# Altium schematic sheet LEDProject.SchDoc
size A3
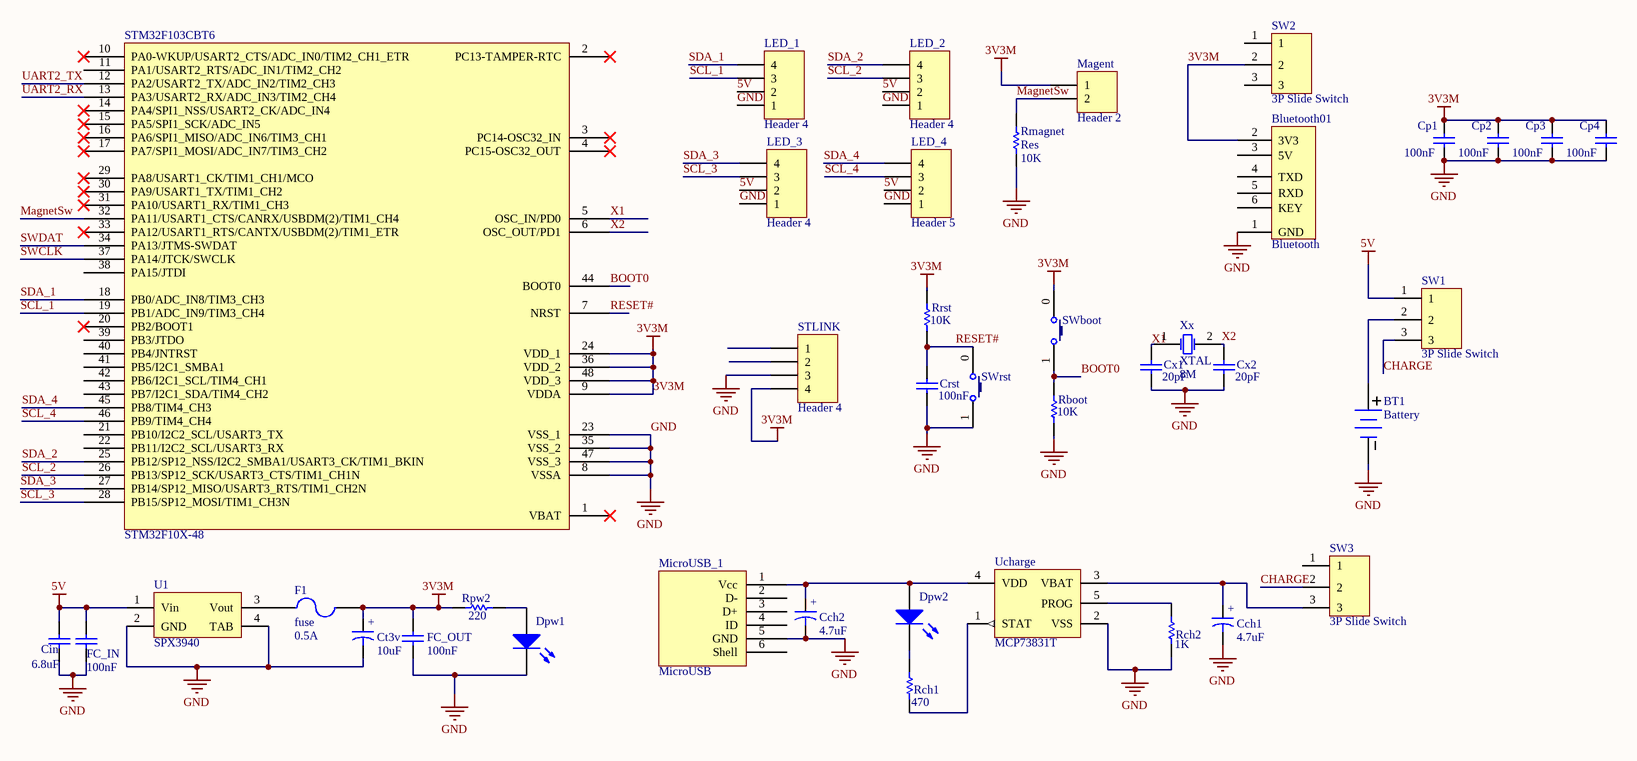
[diagram p0: LEDProject.SchDoc]

## Parts
Bluetooth01  Bluetooth  [Bluetooth Module]
BT1  Battery  [BAT-2]
Cch1  value 4.7uF  [Tantalum Cap Size A]  (hidden comment: CAP2)
Cch2  value 4.7uF  [Tantalum Cap Size A]  (hidden comment: CAP2)
Cin  value 6.8uF  [SMD-C-0805]  (hidden comment: CAP1)
Cp1  value 100nF  [SMD-C-0805]  (hidden comment: CAP1)
Cp2  value 100nF  [SMD-C-0805]  (hidden comment: CAP1)
Cp3  value 100nF  [SMD-C-0805]  (hidden comment: CAP1)
Cp4  value 100nF  [SMD-C-0805]  (hidden comment: CAP1)
Crst  value 100nF  [SMD-C-0805]  (hidden comment: CAP1)
Ct3v  value 10uF  [Tantalum Cap Size A]  (hidden comment: CAP2)
Cx1  value 20pF  [SMD-C-0805]  (hidden comment: CAP1)
Cx2  value 20pF  [SMD-C-0805]  (hidden comment: CAP1)
Dpw1  SMD LED  [SMT LED 0603]  (value not drawn)
Dpw2  SMD LED  [SMT LED 0603]  (value not drawn)
F1  fuse  value 0.5A  [FUSE_SMD]
FC_IN  value 100nF  [SMD-C-0805]  (hidden comment: CAP1)
FC_OUT  value 100nF  [SMD-C-0805]  (hidden comment: CAP1)
LED_1  Header 4  [HDR1X4]
LED_2  Header 4  [HDR1X4]
LED_3  Header 4  [HDR1X4]
LED_4  Header 5  [HDR1X4]
Magent  Header 2  [HDR1X2]
MicroUSB_1  MicroUSB  [MicroUSB]
Rboot  value 10K  [SMD-R-0603]  (hidden comment: Res)
Rch1  value 470  [SMD-R-0603]  (hidden comment: Res)
Rch2  value 1K  [SMD-R-0603]  (hidden comment: Res)
Rmagnet  Res  value 10K  [SMD-R-0603]
Rpw2  value 220  [SMD-R-0603]  (hidden comment: Res)
Rrst  value 10K  [SMD-R-0603]  (hidden comment: Res)
STLINK  Header 4  [HDR1X4]
STM32F103CBT6  STM32F10X-48  [LQFP48_N]
SW1  3P Slide Switch  [3P_Smooth_Switch_90]
SW2  3P Slide Switch  [3P_Smooth_Switch_90]
SW3  3P Slide Switch  [3P_Smooth_Switch_90]
SWboot  SWrst  [Button2_SMD]  (value not drawn)
SWrst  SWrst  [Button2_SMD]  (value not drawn)
U1  SPX3940  [SOT-223]
Ucharge  MCP73831T  [SOT23-5_N]
Xx  XTAL  value 8M  [CRYSTAL-2x6]

## Nets
3V3M: Bluetooth01.2(3V3) Cp1.2 Cp2.2 Cp3.2 Cp4.2 Ct3v.1 F1.2 FC_OUT.2 Magent.1 Rpw2.1 Rrst.2 STLINK.4 STM32F103CBT6.9(VDDA) STM32F103CBT6.24(VDD_1) STM32F103CBT6.36(VDD_2) STM32F103CBT6.48(VDD_3) SW2.2 SWboot.0
5V: Cin.2 FC_IN.2 LED_1.2 LED_2.2 LED_3.2 LED_4.2 SW1.1 U1.1(Vin)
GND: Bluetooth01.1(GND) BT1.2(-) Cch1.2 Cch2.2 Cin.1 Cp1.1 Cp2.1 Cp3.1 Cp4.1 Crst.2 Ct3v.2 Cx1.2 Cx2.2 Dpw1.2(K) FC_IN.1 FC_OUT.1 LED_1.1 LED_2.1 LED_3.1 LED_4.1 MicroUSB_1.5(GND) Rboot.1 Rch2.1 Rmagnet.1 STLINK.3 STM32F103CBT6.8(VSSA) STM32F103CBT6.23(VSS_1) STM32F103CBT6.35(VSS_2) STM32F103CBT6.47(VSS_3) SWrst.1 U1.2(GND) U1.4(TAB) Ucharge.2(VSS)
BOOT0: Rboot.2 STM32F103CBT6.44(BOOT0) SWboot.1
CHARGE: SW1.3 SW3.2
MagnetSw: Magent.2 Rmagnet.2 STM32F103CBT6.32(PA11/USART1_CTS/CANRX/USBDM(2)/TIM1_CH4)
RESET#: Crst.1 Rrst.1 STM32F103CBT6.7(NRST) SWrst.0
SCL_1: LED_1.3 STM32F103CBT6.19(PB1/ADC_IN9/TIM3_CH4)
SCL_2: LED_2.3 STM32F103CBT6.26(PB13/SP12_SCK/USART3_CTS/TIM1_CH1N)
SCL_3: LED_3.3 STM32F103CBT6.28(PB15/SP12_MOSI/TIM1_CH3N)
SCL_4: LED_4.3 STM32F103CBT6.46(PB9/TIM4_CH4)
SDA_1: LED_1.4 STM32F103CBT6.18(PB0/ADC_IN8/TIM3_CH3)
SDA_2: LED_2.4 STM32F103CBT6.25(PB12/SP12_NSS/I2C2_SMBA1/USART3_CK/TIM1_BKIN)
SDA_3: LED_3.4 STM32F103CBT6.27(PB14/SP12_MISO/USART3_RTS/TIM1_CH2N)
SDA_4: LED_4.4 STM32F103CBT6.45(PB8/TIM4_CH3)
SWCLK: STM32F103CBT6.37(PA14/JTCK/SWCLK)
SWDAT: STM32F103CBT6.34(PA13/JTMS-SWDAT)
UART2_RX: STM32F103CBT6.13(PA3/USART2_RX/ADC_IN3/TIM2_CH4)
UART2_TX: STM32F103CBT6.12(PA2/USART2_TX/ADC_IN2/TIM2_CH3)
X1: Cx1.1 STM32F103CBT6.5(OSC_IN/PD0) Xx.1(OSC1)
X2: Cx2.1 STM32F103CBT6.6(OSC_OUT/PD1) Xx.2(OSC2)
NetBT1_1: BT1.1(+) SW1.2
NetCch1_1: Cch1.1 SW3.3 Ucharge.3(VBAT)
NetCch2_1: Cch2.1 Dpw2.1(A) MicroUSB_1.1(Vcc) Ucharge.4(VDD)
NetDpw1_1: Dpw1.1(A) Rpw2.2
NetDpw2_2: Dpw2.2(K) Rch1.2
NetF1_1: F1.1 U1.3(Vout)
NetRch1_1: Rch1.1 Ucharge.1(STAT)
NetRch2_2: Rch2.2 Ucharge.5(PROG)

Not connected (* = marked no-connect by the designer): Bluetooth01 3(5V) 4(TXD) 5(RXD) 6(KEY); MicroUSB_1 2(D-) 3(D+) 4(ID) 6(Shell); STLINK 1 2; STM32F103CBT6 1(VBAT)* 2(PC13-TAMPER-RTC)* 3(PC14-OSC32_IN)* 4(PC15-OSC32_OUT)* 10(PA0-WKUP/USART2_CTS/ADC_IN0/TIM2_CH1_ETR)* 11(PA1/USART2_RTS/ADC_IN1/TIM2_CH2) 14(PA4/SPI1_NSS/USART2_CK/ADC_IN4)* 15(PA5/SPI1_SCK/ADC_IN5)* 16(PA6/SPI1_MISO/ADC_IN6/TIM3_CH1)* 17(PA7/SPI1_MOSI/ADC_IN7/TIM3_CH2)* 20(PB2/BOOT1)* 21(PB10/I2C2_SCL/USART3_TX) 22(PB11/I2C2_SCL/USART3_RX) 29(PA8/USART1_CK/TIM1_CH1/MCO)* 30(PA9/USART1_TX/TIM1_CH2)* 31(PA10/USART1_RX/TIM1_CH3)* 33(PA12/USART1_RTS/CANTX/USBDM(2)/TIM1_ETR)* 38(PA15/JTDI) 39(PB3/JTDO) 40(PB4/JNTRST) 41(PB5/I2C1_SMBA1) 42(PB6/I2C1_SCL/TIM4_CH1) 43(PB7/I2C1_SDA/TIM4_CH2); SW2 1 3; SW3 1

## Notes on the sheet
- (in symbol CAP2) +

## Library data of the parts
Bluetooth01 = Bluetooth Module
BT1 = Battery: Multicell Battery; Published: 24-Mar-1999; LatestRevisionDate: 17-Jul-2002; LatestRevisionNote: Re-released for DXP Platform.; PackageReference: BAT-2; Publisher: Altium Limited; PackageDescription: Battery; 2 Leads
Cch1 Cch2 Ct3v = CAP2: Electrolytic CAP
Cin Cp1-Cp4 Crst Cx1 Cx2 FC_IN FC_OUT = CAP1: Capacitor_SMD
Dpw1 Dpw2 = SMD LED: Typical RED GaAs LED; Published: 8-Jun-2000; LatestRevisionDate: 08-Jul-2005; LatestRevisionNote: Mech Layer 1 removed.; PackageReference: LED-1; Publisher: Altium Limited; PackageDescription: LED; 2 Leads
LED_1-LED_4 STLINK = Header 4: Header, 4-Pin; LatestRevisionDate: 17-Jul-2002; LatestRevisionNote: Re-released for DXP Platform.; Publisher: Altium Limited
Magent = Header 2: Header, 2-Pin; LatestRevisionDate: 17-Jul-2002; LatestRevisionNote: Re-released for DXP Platform.; Publisher: Altium Limited
Rboot Rch1 Rch2 Rmagnet Rpw2 Rrst = Res: Resistor; Published: 8-Jun-2000; LatestRevisionDate: 17-Jul-2002; LatestRevisionNote: Re-released for DXP Platform.; PackageReference: AXIAL-0.3; Publisher: Altium Limited; PackageDescription: Axial Device, Thru-Hole; 2 Leads; 0.3 in Pin Spacing
STM32F103CBT6 = STM32F10X-48: STM32 ARM-based 32-bit MCU , 48-pin LQFP, Industrial Temperature; Published: 30-May-2008; DatasheetVersion: rev6, Mar-2008; PackageVersion: Mar-2008; PackageReference: LQFP48; Publisher: Altium Limited; PackageDescription: 48-Pin Low-Profile Quad Flat Pack, 7 x 7 mm Body, 0.5 mm Pitch (LQFP48); ComponentLink1Description: Manufacturer Link; ComponentLink1URL: www.st.com/stm32; ComponentLink2Description: Datasheet; ComponentLink2URL: http://www.st.com/stonline/products/literature/ds/13587.pdf
SW1-SW3 = 3P Slide Switch: 3Pin Slide Switch
SWboot SWrst = Button2_SMD
U1 = SPX3940: 1A Low Dropout Voltage Regulator
Ucharge = MCP73831T: LatestRevisionDate: 17-Jul-2002; LatestRevisionNote: Re-released for DXP Platform.; Publisher: Altium Limited